# EAGLE design PCB-TOP (EAGLE 9.6.2)
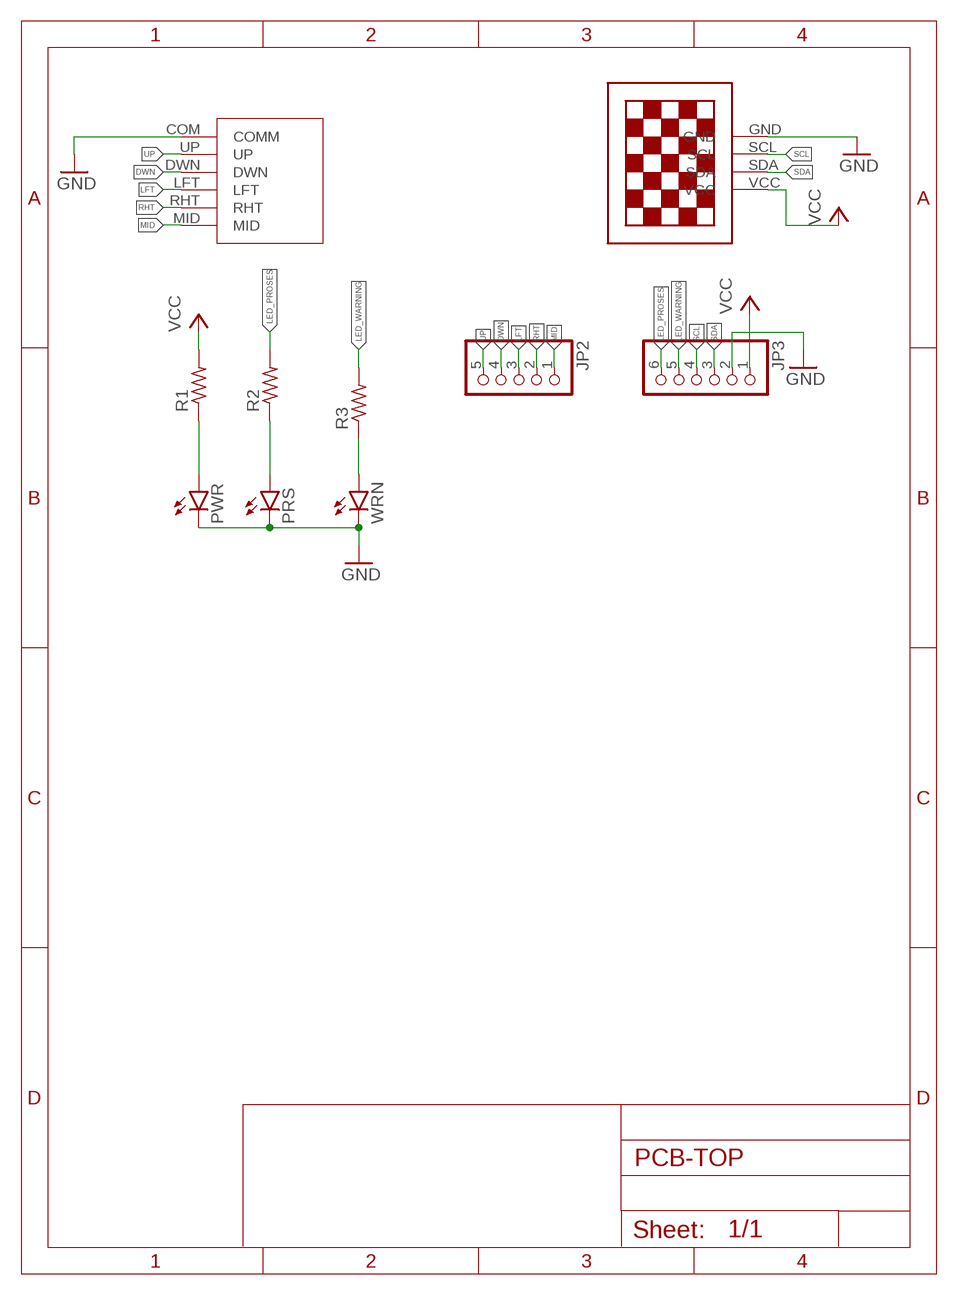
[diagram p0: schematic, sheet 1]

## Parts
JP2  PINHD-1X5  [1X05]
JP3  PINHD-1X6  [1X06]
NAV-SWITCH6P1  NAV-SWITCH6P  [NAV-SWITCH6P]
PRS  TLLR4400  [LED3MM]
PWR  TLLR4400  [LED3MM]
R1  R-US_M0805  [M0805]
R2  R-US_M0805  [M0805]
R3  R-US_M0805  [M0805]
U$1  13"OLED13"OLED  [1.3"OLED]
WRN  TLLR4400  [LED3MM]

## Nets
DWN: JP2.4 NAV-SWITCH6P1.DWN
GND: JP3.2 NAV-SWITCH6P1.COM(COMM) PRS.K(C) PWR.K(C) U$1.GND WRN.K(C)
LED_PROSES: JP3.6 R2.2
LED_WARNING: JP3.5 R3.2
LFT: JP2.3 NAV-SWITCH6P1.LFT
MID: JP2.1 NAV-SWITCH6P1.MID
N$11: PWR.A R1.1
N$14: PRS.A R2.1
N$15: R3.1 WRN.A
RHT: JP2.2 NAV-SWITCH6P1.RHT
SCL: JP3.4 U$1.SCL
SDA: JP3.3 U$1.SDA
UP: JP2.5 NAV-SWITCH6P1.UP
VCC: JP3.1 R1.2 U$1.VCC

## Library data of the parts
JP2 = pinhead:PINHD-1X5: PIN HEADER
JP3 = pinhead:PINHD-1X6: PIN HEADER
NAV-SWITCH6P1 = NAV-SWITCH6P:NAV-SWITCH6P
PRS PWR WRN = led:TLLR4400: Low Current (2mA) LED 3 mm Tinted Diffused Package color RED Source: Data sheet <http://www.farnell.com/datasheets/391100.pdf>; MF: VISHAY SEMICONDUCTOR; OC_FARNELL: 1612437
R1-R3 = adafruit:R-US_: RESISTOR, American symbol
U$1 = 13oled:13"OLED

## Board
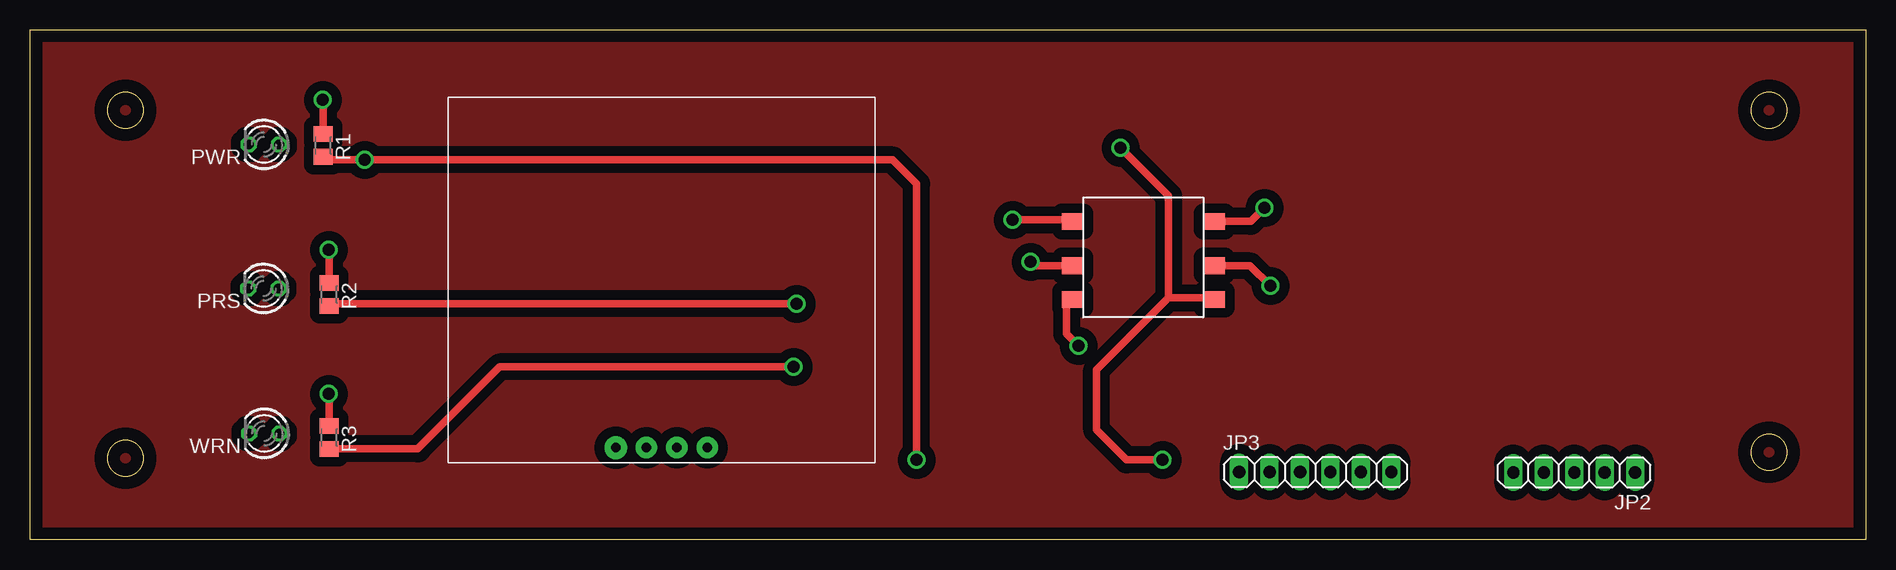
[diagram p1: board, top side]
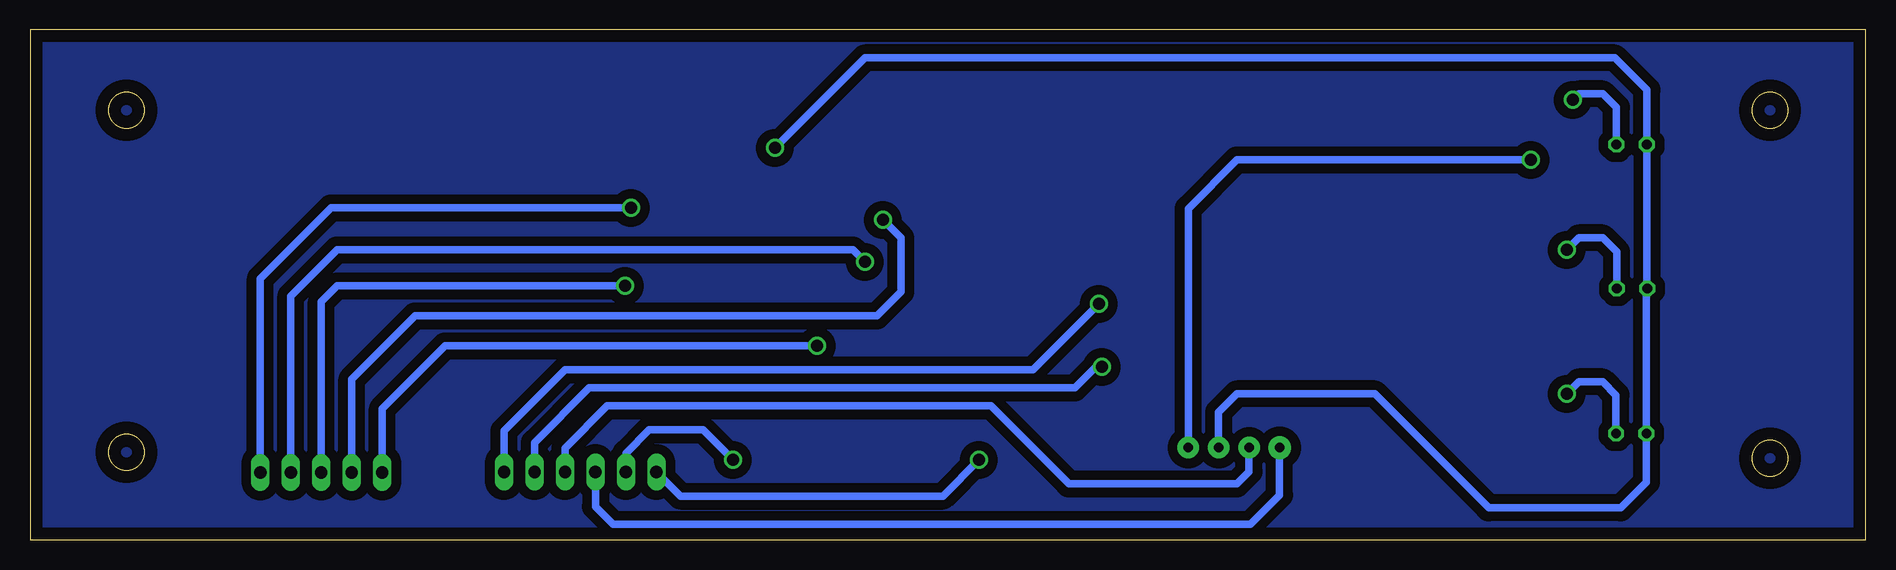
[diagram p2: board, bottom side, seen from below]

Size 153 x 42.5 mm. Coordinates in mm from the lower left corner, seen from the top.
Outline: 0,0 0,42.5 153,42.5 153,0 0,0
Outline: circle at 7.96,6.82 radius 1.5
Outline: circle at 7.96,35.82 radius 1.5
Outline: circle at 144.96,7.32 radius 1.5
Outline: circle at 144.96,35.82 radius 1.5
Copper layers (1*16): Top 0.035mm / dielectric 1.5mm / Bottom 0.035mm
Design rules "default": minimum track width 6mil, minimum drill 0.35mm, track to track 6mil, track to pad 6mil, pad to pad 6mil, via to via 6mil, smd to smd 6mil, copper to edge 40mil, drill to drill 6mil, minimum pad ring 10mil, minimum via ring 8mil, stop-mask expansion 4mil, vias tented up to drill 0mil, thermal gap 10mil

### Footprints (pad centres in the part's own frame; a part is rotated, then mirrored left to right if it is on the bottom)
1X05 = drill 1.016 long: 1 -5.08,0; 2 -2.54,0; 3 0,0; 4 2.54,0; 5 5.08,0
1X06 = drill 1.016 long: 1 -6.35,0; 2 -3.81,0; 3 -1.27,0; 4 1.27,0; 5 3.81,0; 6 6.35,0
NAV-SWITCH6P = smd 1.8 x 1.4: COM 6.9,-5.5; DWN -4.9,1; LFT 6.9,-2.7; MID 6.9,1; RHT -4.9,-2.7; UP -4.9,-5.5
LED3MM = drill 0.813 octagon: A -1.27,0; K 1.27,0
M0805 = smd 1.3 x 1.6: 1 -0.95,0; 2 0.95,0
1.3"OLED = drill 0.8 pad 1.778: GND 2.54,0; SCL 5.08,0; VCC 0,0 | drill 0.8 pad 1.9: SDA 7.62,0

### Placement (x,y rotation side)
JP2  128.72,5.62 180 top
JP3  107.14,5.66 0 top
NAV-SWITCH6P1  91.81,25.54 0 top
PRS  19.47,20.95 180 top
PWR  19.5,32.95 180 top
R1  24.43,32.88 270 top
R2  24.93,20.46 270 top
R3  24.93,8.54 270 top
U$1  56.46,7.69 180 top
WRN  19.53,8.87 180 top

### Tracks (layer width: path | path; a pad name or v marks a point on that pad's centre or on a via)
DWN  (via drill 1)
  Top 0.61: v81.9,26.67 86.78,26.67 NAV-SWITCH6P1.DWN
  Bottom 0.61: JP2.4 126.18,13.39 120.9,18.67 82.4,18.67 80.4,20.67 80.4,25.17 v81.9,26.67
GND  (via drill 1)
  Top 0.61: v94.4,6.67 91.4,6.67 88.9,9.17 88.9,14.17 94.9,20.17 | 94.9,20.17 98.58,20.17 NAV-SWITCH6P1.COM | v90.9,32.67 94.9,28.67 94.9,20.17
  Bottom 0.61: JP3.2 103.33,7.24 101.4,9.17 96.9,9.17 v94.4,6.67 | U$1.GND 53.92,10.65 52.4,12.17 40.9,12.17 31.4,2.67 20.4,2.67 18.26,4.81 WRN.K 18.26,20.89 PRS.K 18.23,20.98 PWR.K 18.23,37.5 20.9,40.17 83.4,40.17 v90.9,32.67
LED_PROSES  (via drill 1)
  Top 0.61: v63.9,19.67 25.09,19.67 R2.2
  Bottom 0.61: JP3.6 113.49,9.08 108.4,14.17 69.4,14.17 v63.9,19.67
LED_WARNING  (via drill 1)
  Top 0.61: v63.65,14.42 39.15,14.42 32.32,7.59 R3.2
  Bottom 0.61: JP3.5 110.95,8.12 106.4,12.67 65.9,12.67 63.9,14.67 v63.65,14.42
LFT  (via drill 1)
  Top 0.61: v103.4,21.17 103.38,21.17 101.71,22.84 NAV-SWITCH6P1.LFT
  Bottom 0.61: JP2.3 128.72,19.85 127.4,21.17 v103.4,21.17
MID  (via drill 1)
  Top 0.61: v102.9,27.67 101.77,26.54 NAV-SWITCH6P1.MID
  Bottom 0.61: JP2.1 133.8,21.77 127.9,27.67 v102.9,27.67
N$1
  pour Top (isolate 0.813): -0.1,42.67 152.9,42.67 152.9,0.17 -0.1,0.17
N$2
  pour Bottom (isolate 0.813): -0.1,42.67 152.9,42.67 152.9,0.17 -0.1,0.17
N$11  (via drill 1)
  Top 0.61: v24.4,36.67 24.43,36.64 R1.1
  Bottom 0.61: PWR.A 20.77,36.04 21.9,37.17 23.9,37.17 v24.4,36.67
N$14  (via drill 1)
  Top 0.61: v24.9,24.17 24.93,24.14 R2.1
  Bottom 0.61: PRS.A 20.74,24.01 21.9,25.17 23.9,25.17 v24.9,24.17
N$15  (via drill 1)
  Top 0.61: v24.9,12.17 24.93,12.14 R3.1
  Bottom 0.61: WRN.A 20.8,12.07 21.9,13.17 23.9,13.17 v24.9,12.17
RHT  (via drill 1)
  Top 0.61: v83.4,23.17 83.73,22.84 NAV-SWITCH6P1.RHT
  Bottom 0.61: JP2.2 131.26,20.31 127.4,24.17 84.4,24.17 v83.4,23.17
SCL
  Bottom 0.61: JP3.4 108.41,7.66 104.9,11.17 72.9,11.17 66.4,4.67 52.4,4.67 51.38,5.69 U$1.SCL
SDA
  Bottom 0.61: JP3.3 105.87,2.79 104.4,1.32 51.25,1.32 48.84,3.73 U$1.SDA
UP  (via drill 1)
  Top 0.61: NAV-SWITCH6P1.UP 86.4,19.53 86.4,17.17 v87.4,16.17
  Bottom 0.61: JP2.5 123.64,10.93 118.4,16.17 v87.4,16.17
VCC  (via drill 1)
  Top 0.61: R1.2 24.69,31.67 v27.9,31.67 71.9,31.67 73.9,29.67 v73.9,6.67
  Bottom 0.61: U$1.VCC 56.46,27.61 52.4,31.67 v27.9,31.67 | JP3.1 98.79,3.66 76.91,3.66 v73.9,6.67